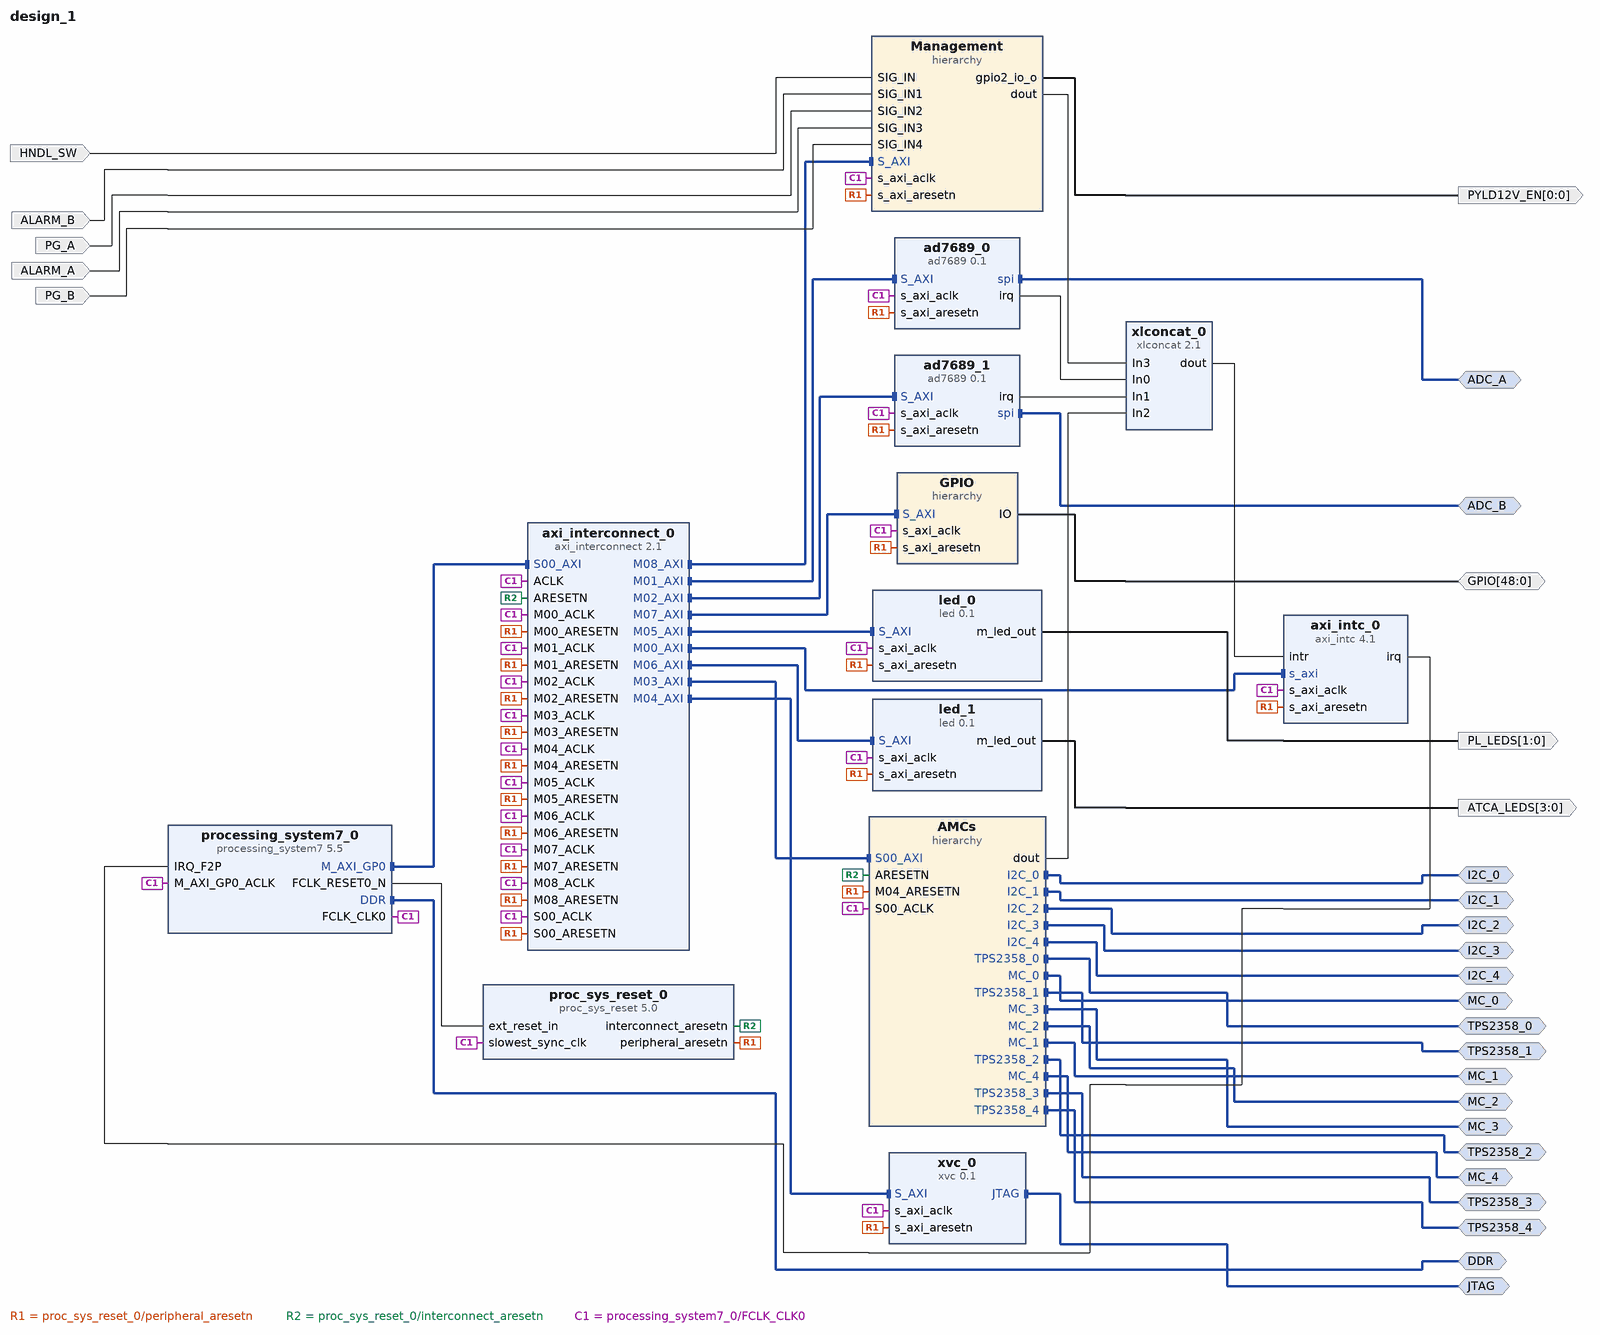
[diagram p0: block diagram of the top level]
# Vivado block design design_1, xc7z020clg400-1, Vivado 2017.2
create_bd_design design_1

create_bd_intf_port -mode Master -vlnv xilinx.com:interface:ddrx_rtl:1.0 DDR
create_bd_intf_port -mode Master -vlnv uw:uw:spi_rtl:1.0 ADC_A
create_bd_intf_port -mode Master -vlnv uw:uw:spi_rtl:1.0 ADC_B
create_bd_intf_port -mode Master -vlnv uw:uw:i2c_rtl:1.0 I2C_0
create_bd_intf_port -mode Master -vlnv uw:uw:tps2358_rtl:1.0 TPS2358_0
create_bd_intf_port -mode Master -vlnv uw:uw:i2c_rtl:1.0 I2C_1
create_bd_intf_port -mode Master -vlnv uw:uw:tps2358_rtl:1.0 TPS2358_1
create_bd_intf_port -mode Master -vlnv uw:uw:i2c_rtl:1.0 I2C_2
create_bd_intf_port -mode Master -vlnv uw:uw:tps2358_rtl:1.0 TPS2358_2
create_bd_intf_port -mode Master -vlnv uw:uw:i2c_rtl:1.0 I2C_3
create_bd_intf_port -mode Master -vlnv uw:uw:tps2358_rtl:1.0 TPS2358_3
create_bd_intf_port -mode Master -vlnv uw:uw:i2c_rtl:1.0 I2C_4
create_bd_intf_port -mode Master -vlnv uw:uw:tps2358_rtl:1.0 TPS2358_4
create_bd_intf_port -mode Master -vlnv uw:uw:mc_rtl:1.0 MC_0
create_bd_intf_port -mode Master -vlnv uw:uw:mc_rtl:1.0 MC_4
create_bd_intf_port -mode Master -vlnv uw:uw:mc_rtl:1.0 MC_3
create_bd_intf_port -mode Master -vlnv uw:uw:mc_rtl:1.0 MC_2
create_bd_intf_port -mode Master -vlnv uw:uw:mc_rtl:1.0 MC_1
create_bd_intf_port -mode Master -vlnv uw:uw:jtag_rtl:1.0 JTAG
create_bd_port -dir O -from 1 -to 0 PL_LEDS
create_bd_port -dir O -from 3 -to 0 ATCA_LEDS
create_bd_port -dir IO -from 48 -to 0 GPIO
create_bd_port -dir O -from 0 -to 0 PYLD12V_EN
create_bd_port -dir I HNDL_SW
create_bd_port -dir I ALARM_B
create_bd_port -dir I PG_A
create_bd_port -dir I ALARM_A
create_bd_port -dir I PG_B

create_bd_cell -type ip -vlnv user.org:user:ad7689:0.1 ad7689_0
create_bd_cell -type ip -vlnv user.org:user:ad7689:0.1 ad7689_1
create_bd_cell -type hier AMCs
create_bd_cell -type ip -vlnv uw:uw:led:0.1 led_0
set_property -dict {CONFIG.C_ACTIVE_HIGH false} [get_bd_cells led_0]
create_bd_cell -type ip -vlnv uw:uw:led:0.1 led_1
set_property -dict {CONFIG.C_LED_INTERFACES 4} [get_bd_cells led_1]
create_bd_cell -type hier GPIO
create_bd_cell -type hier Management
create_bd_cell -type ip -vlnv xilinx.com:ip:axi_intc:4.1 axi_intc_0
set_property -dict [list \
  CONFIG.C_NUM_SW_INTR 0 \
  CONFIG.Sense_of_IRQ_Level_Type Active_High \
  CONFIG.C_EN_CASCADE_MODE 0 \
  CONFIG.C_IRQ_CONNECTION 1 \
] [get_bd_cells axi_intc_0]
create_bd_cell -type ip -vlnv xilinx.com:ip:axi_interconnect:2.1 axi_interconnect_0
set_property -dict [list \
  CONFIG.NUM_SI 1 \
  CONFIG.NUM_MI 9 \
  CONFIG.STRATEGY 0 \
  CONFIG.S00_HAS_DATA_FIFO 2 \
  CONFIG.S01_HAS_DATA_FIFO 2 \
] [get_bd_cells axi_interconnect_0]
create_bd_cell -type ip -vlnv xilinx.com:ip:proc_sys_reset:5.0 proc_sys_reset_0
create_bd_cell -type ip -vlnv xilinx.com:ip:processing_system7:5.5 processing_system7_0
set_property -dict [list \
  CONFIG.PCW_FCLK_CLK1_BUF TRUE \
  CONFIG.PCW_I2C_PERIPHERAL_FREQMHZ 111.111115 \
  CONFIG.PCW_FPGA0_PERIPHERAL_FREQMHZ 50 \
  CONFIG.PCW_FPGA1_PERIPHERAL_FREQMHZ 100 \
  CONFIG.PCW_USE_FABRIC_INTERRUPT 1 \
  CONFIG.PCW_EN_CLK1_PORT 1 \
  CONFIG.PCW_IRQ_F2P_INTR 1 \
  CONFIG.PCW_GP0_EN_MODIFIABLE_TXN 0 \
  CONFIG.PCW_GP1_EN_MODIFIABLE_TXN 0 \
  CONFIG.PCW_PRESET_BANK1_VOLTAGE {LVCMOS 1.8V} \
  CONFIG.PCW_UIPARAM_DDR_BUS_WIDTH {16 Bit} \
  CONFIG.PCW_UIPARAM_DDR_PARTNO {MT41K128M16 JT-125} \
  CONFIG.PCW_QSPI_PERIPHERAL_ENABLE 1 \
  CONFIG.PCW_QSPI_QSPI_IO {MIO 1 .. 6} \
  CONFIG.PCW_QSPI_GRP_SINGLE_SS_ENABLE 1 \
  CONFIG.PCW_QSPI_GRP_SINGLE_SS_IO {MIO 1 .. 6} \
  CONFIG.PCW_QSPI_GRP_FBCLK_ENABLE 1 \
  CONFIG.PCW_QSPI_GRP_FBCLK_IO {MIO 8} \
  CONFIG.PCW_ENET0_PERIPHERAL_ENABLE 1 \
  CONFIG.PCW_ENET0_ENET0_IO {MIO 16 .. 27} \
  CONFIG.PCW_ENET0_GRP_MDIO_ENABLE 1 \
  CONFIG.PCW_ENET0_GRP_MDIO_IO {MIO 52 .. 53} \
  CONFIG.PCW_ENET0_RESET_ENABLE 1 \
  CONFIG.PCW_ENET0_RESET_IO {MIO 9} \
  CONFIG.PCW_UART0_PERIPHERAL_ENABLE 1 \
  CONFIG.PCW_UART0_UART0_IO {MIO 14 .. 15} \
  CONFIG.PCW_SPI0_PERIPHERAL_ENABLE 1 \
  CONFIG.PCW_SPI0_SPI0_IO {MIO 28 .. 33} \
  CONFIG.PCW_SPI0_GRP_SS1_ENABLE 1 \
  CONFIG.PCW_I2C0_PERIPHERAL_ENABLE 1 \
  CONFIG.PCW_I2C0_I2C0_IO {MIO 10 .. 11} \
  CONFIG.PCW_I2C1_PERIPHERAL_ENABLE 1 \
  CONFIG.PCW_I2C1_I2C1_IO {MIO 12 .. 13} \
  CONFIG.PCW_GPIO_MIO_GPIO_ENABLE 1 \
  CONFIG.PCW_FPGA_FCLK1_ENABLE 1 \
] [get_bd_cells processing_system7_0]
# 118 more settings of processing_system7_0 are not shown: defaults, MIO pin electricals, DDR timing, and values the tool derives
create_bd_cell -type ip -vlnv xilinx.com:ip:xlconcat:2.1 xlconcat_0
set_property -dict {CONFIG.NUM_PORTS 4 CONFIG.dout_width 27} [get_bd_cells xlconcat_0]
create_bd_cell -type ip -vlnv user.org:user:xvc:0.1 xvc_0

# ---- hierarchy /AMCs ----
current_bd_instance /AMCs
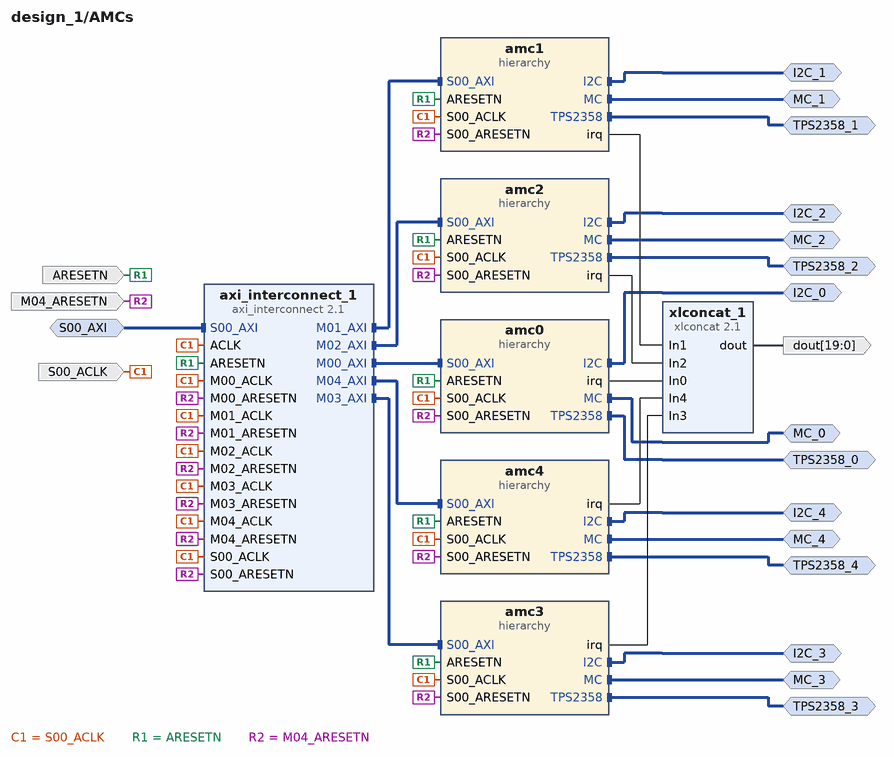
[diagram p1: block diagram inside /AMCs]
create_bd_intf_pin -mode Slave -vlnv xilinx.com:interface:aximm_rtl:1.0 S00_AXI
create_bd_intf_pin -mode Master -vlnv uw:uw:tps2358_rtl:1.0 TPS2358_1
create_bd_intf_pin -mode Master -vlnv uw:uw:i2c_rtl:1.0 I2C_1
create_bd_intf_pin -mode Master -vlnv uw:uw:mc_rtl:1.0 MC_1
create_bd_intf_pin -mode Master -vlnv uw:uw:i2c_rtl:1.0 I2C_2
create_bd_intf_pin -mode Master -vlnv uw:uw:tps2358_rtl:1.0 TPS2358_2
create_bd_intf_pin -mode Master -vlnv uw:uw:mc_rtl:1.0 MC_2
create_bd_intf_pin -mode Master -vlnv uw:uw:i2c_rtl:1.0 I2C_0
create_bd_intf_pin -mode Master -vlnv uw:uw:tps2358_rtl:1.0 TPS2358_0
create_bd_intf_pin -mode Master -vlnv uw:uw:mc_rtl:1.0 MC_0
create_bd_intf_pin -mode Master -vlnv uw:uw:tps2358_rtl:1.0 TPS2358_4
create_bd_intf_pin -mode Master -vlnv uw:uw:i2c_rtl:1.0 I2C_4
create_bd_intf_pin -mode Master -vlnv uw:uw:mc_rtl:1.0 MC_4
create_bd_intf_pin -mode Master -vlnv uw:uw:tps2358_rtl:1.0 TPS2358_3
create_bd_intf_pin -mode Master -vlnv uw:uw:i2c_rtl:1.0 I2C_3
create_bd_intf_pin -mode Master -vlnv uw:uw:mc_rtl:1.0 MC_3
create_bd_pin -dir I -type clk S00_ACLK
create_bd_pin -dir I -type rst ARESETN
create_bd_pin -dir I -type rst M04_ARESETN
create_bd_pin -dir O -from 19 -to 0 dout

create_bd_cell -type hier amc1
create_bd_cell -type hier amc2
create_bd_cell -type hier amc0
create_bd_cell -type hier amc4
create_bd_cell -type hier amc3
create_bd_cell -type ip -vlnv xilinx.com:ip:axi_interconnect:2.1 axi_interconnect_1
set_property -dict {CONFIG.NUM_MI 5} [get_bd_cells axi_interconnect_1]
create_bd_cell -type ip -vlnv xilinx.com:ip:xlconcat:2.1 xlconcat_1
set_property -dict {CONFIG.NUM_PORTS 5 CONFIG.dout_width 20} [get_bd_cells xlconcat_1]

# ---- hierarchy /AMCs/amc1 ----
current_bd_instance /AMCs/amc1
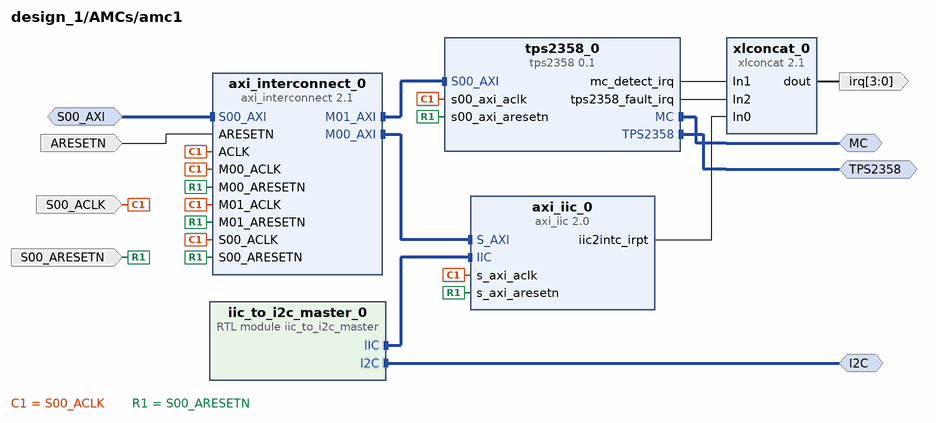
[diagram p2: block diagram inside /AMCs/amc1]
create_bd_intf_pin -mode Master -vlnv uw:uw:i2c_rtl:1.0 I2C
create_bd_intf_pin -mode Master -vlnv uw:uw:tps2358_rtl:1.0 TPS2358
create_bd_intf_pin -mode Slave -vlnv xilinx.com:interface:aximm_rtl:1.0 S00_AXI
create_bd_intf_pin -mode Master -vlnv uw:uw:mc_rtl:1.0 MC
create_bd_pin -dir I -type clk S00_ACLK
create_bd_pin -dir I -type rst S00_ARESETN
create_bd_pin -dir O -from 3 -to 0 irq
create_bd_pin -dir I -type rst ARESETN

create_bd_cell -type ip -vlnv user.org:user:tps2358:0.1 tps2358_0
create_bd_cell -type ip -vlnv xilinx.com:ip:axi_iic:2.0 axi_iic_0
create_bd_cell -type ip -vlnv xilinx.com:ip:axi_interconnect:2.1 axi_interconnect_0
create_bd_cell -type ip -vlnv xilinx.com:ip:xlconcat:2.1 xlconcat_0
set_property -dict {CONFIG.NUM_PORTS 3 CONFIG.IN2_WIDTH 2 CONFIG.dout_width 4} [get_bd_cells xlconcat_0]
create_bd_cell -type module -reference iic_to_i2c_master iic_to_i2c_master_0

# ---- hierarchy /AMCs/amc2 ----
current_bd_instance /AMCs/amc2
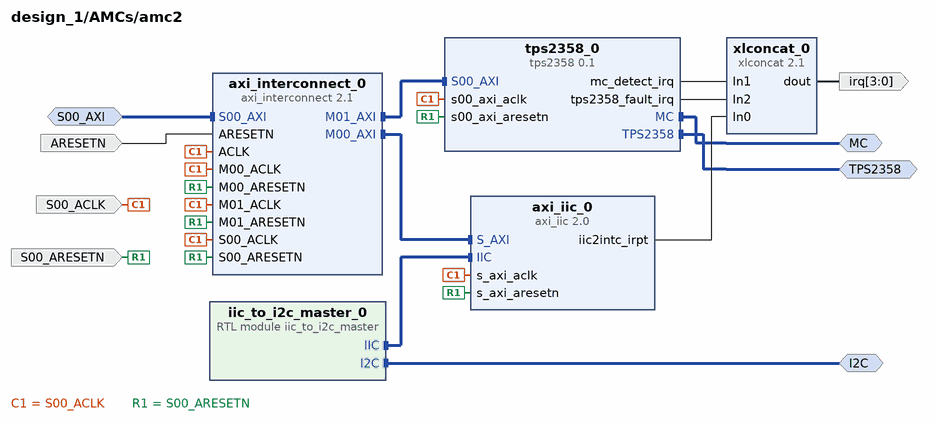
[diagram p3: block diagram inside /AMCs/amc2]
create_bd_intf_pin -mode Master -vlnv uw:uw:i2c_rtl:1.0 I2C
create_bd_intf_pin -mode Master -vlnv uw:uw:tps2358_rtl:1.0 TPS2358
create_bd_intf_pin -mode Slave -vlnv xilinx.com:interface:aximm_rtl:1.0 S00_AXI
create_bd_intf_pin -mode Master -vlnv uw:uw:mc_rtl:1.0 MC
create_bd_pin -dir I -type clk S00_ACLK
create_bd_pin -dir I -type rst S00_ARESETN
create_bd_pin -dir O -from 3 -to 0 irq
create_bd_pin -dir I -type rst ARESETN

create_bd_cell -type ip -vlnv user.org:user:tps2358:0.1 tps2358_0
create_bd_cell -type ip -vlnv xilinx.com:ip:axi_iic:2.0 axi_iic_0
create_bd_cell -type ip -vlnv xilinx.com:ip:axi_interconnect:2.1 axi_interconnect_0
create_bd_cell -type ip -vlnv xilinx.com:ip:xlconcat:2.1 xlconcat_0
set_property -dict {CONFIG.NUM_PORTS 3 CONFIG.IN2_WIDTH 2 CONFIG.dout_width 4} [get_bd_cells xlconcat_0]
create_bd_cell -type module -reference iic_to_i2c_master iic_to_i2c_master_0

# ---- hierarchy /AMCs/amc0 ----
current_bd_instance /AMCs/amc0
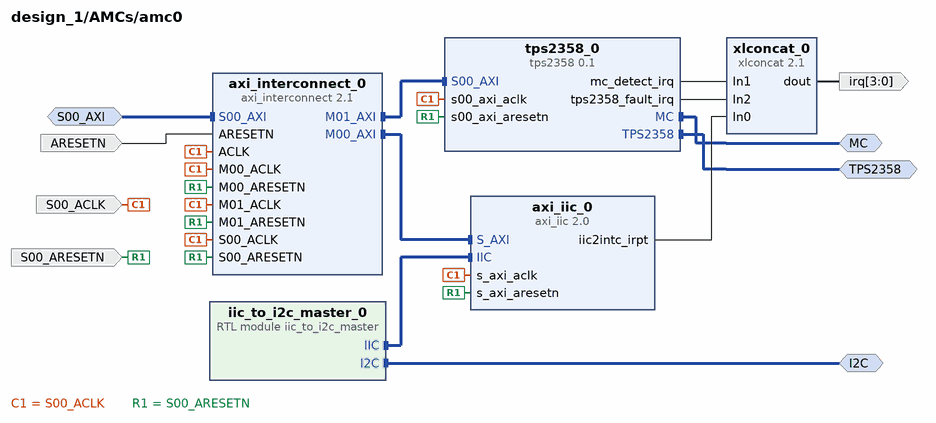
[diagram p4: block diagram inside /AMCs/amc0]
create_bd_intf_pin -mode Master -vlnv uw:uw:i2c_rtl:1.0 I2C
create_bd_intf_pin -mode Master -vlnv uw:uw:tps2358_rtl:1.0 TPS2358
create_bd_intf_pin -mode Slave -vlnv xilinx.com:interface:aximm_rtl:1.0 S00_AXI
create_bd_intf_pin -mode Master -vlnv uw:uw:mc_rtl:1.0 MC
create_bd_pin -dir I -type clk S00_ACLK
create_bd_pin -dir I -type rst S00_ARESETN
create_bd_pin -dir O -from 3 -to 0 irq
create_bd_pin -dir I -type rst ARESETN

create_bd_cell -type ip -vlnv user.org:user:tps2358:0.1 tps2358_0
create_bd_cell -type ip -vlnv xilinx.com:ip:axi_iic:2.0 axi_iic_0
create_bd_cell -type ip -vlnv xilinx.com:ip:axi_interconnect:2.1 axi_interconnect_0
create_bd_cell -type ip -vlnv xilinx.com:ip:xlconcat:2.1 xlconcat_0
set_property -dict {CONFIG.NUM_PORTS 3 CONFIG.IN2_WIDTH 2 CONFIG.dout_width 4} [get_bd_cells xlconcat_0]
create_bd_cell -type module -reference iic_to_i2c_master iic_to_i2c_master_0

# ---- hierarchy /AMCs/amc4 ----
current_bd_instance /AMCs/amc4
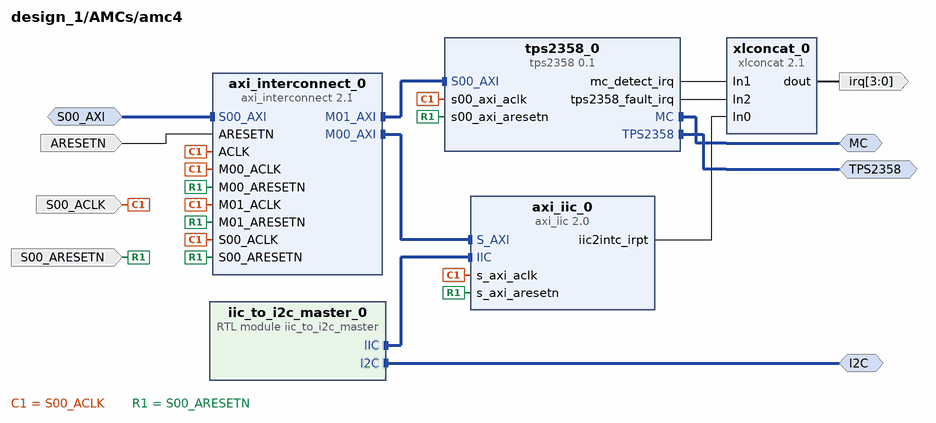
[diagram p5: block diagram inside /AMCs/amc4]
create_bd_intf_pin -mode Master -vlnv uw:uw:i2c_rtl:1.0 I2C
create_bd_intf_pin -mode Master -vlnv uw:uw:tps2358_rtl:1.0 TPS2358
create_bd_intf_pin -mode Slave -vlnv xilinx.com:interface:aximm_rtl:1.0 S00_AXI
create_bd_intf_pin -mode Master -vlnv uw:uw:mc_rtl:1.0 MC
create_bd_pin -dir I -type clk S00_ACLK
create_bd_pin -dir I -type rst S00_ARESETN
create_bd_pin -dir O -from 3 -to 0 irq
create_bd_pin -dir I -type rst ARESETN

create_bd_cell -type ip -vlnv user.org:user:tps2358:0.1 tps2358_0
create_bd_cell -type ip -vlnv xilinx.com:ip:axi_iic:2.0 axi_iic_0
create_bd_cell -type ip -vlnv xilinx.com:ip:axi_interconnect:2.1 axi_interconnect_0
create_bd_cell -type ip -vlnv xilinx.com:ip:xlconcat:2.1 xlconcat_0
set_property -dict {CONFIG.NUM_PORTS 3 CONFIG.IN2_WIDTH 2 CONFIG.dout_width 4} [get_bd_cells xlconcat_0]
create_bd_cell -type module -reference iic_to_i2c_master iic_to_i2c_master_0

# ---- hierarchy /AMCs/amc3 ----
current_bd_instance /AMCs/amc3
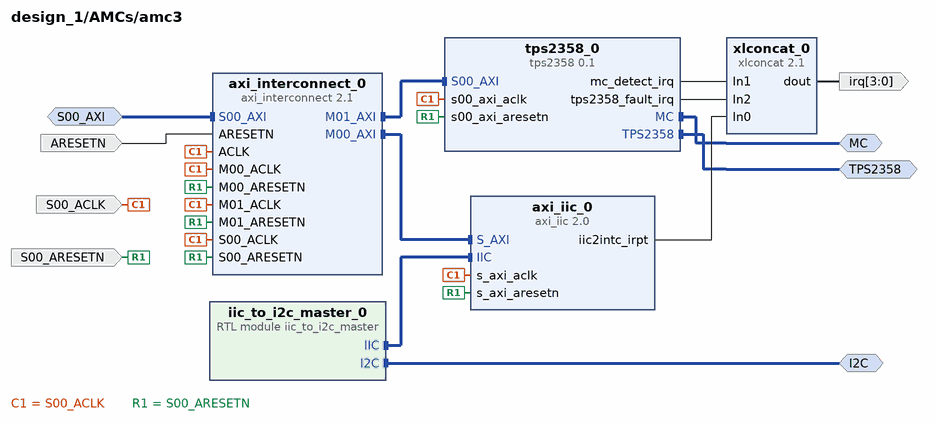
[diagram p6: block diagram inside /AMCs/amc3]
create_bd_intf_pin -mode Master -vlnv uw:uw:i2c_rtl:1.0 I2C
create_bd_intf_pin -mode Master -vlnv uw:uw:tps2358_rtl:1.0 TPS2358
create_bd_intf_pin -mode Slave -vlnv xilinx.com:interface:aximm_rtl:1.0 S00_AXI
create_bd_intf_pin -mode Master -vlnv uw:uw:mc_rtl:1.0 MC
create_bd_pin -dir I -type clk S00_ACLK
create_bd_pin -dir I -type rst S00_ARESETN
create_bd_pin -dir O -from 3 -to 0 irq
create_bd_pin -dir I -type rst ARESETN

create_bd_cell -type ip -vlnv user.org:user:tps2358:0.1 tps2358_0
create_bd_cell -type ip -vlnv xilinx.com:ip:axi_iic:2.0 axi_iic_0
create_bd_cell -type ip -vlnv xilinx.com:ip:axi_interconnect:2.1 axi_interconnect_0
create_bd_cell -type ip -vlnv xilinx.com:ip:xlconcat:2.1 xlconcat_0
set_property -dict {CONFIG.NUM_PORTS 3 CONFIG.IN2_WIDTH 2 CONFIG.dout_width 4} [get_bd_cells xlconcat_0]
create_bd_cell -type module -reference iic_to_i2c_master iic_to_i2c_master_0

# ---- hierarchy /GPIO ----
current_bd_instance /GPIO
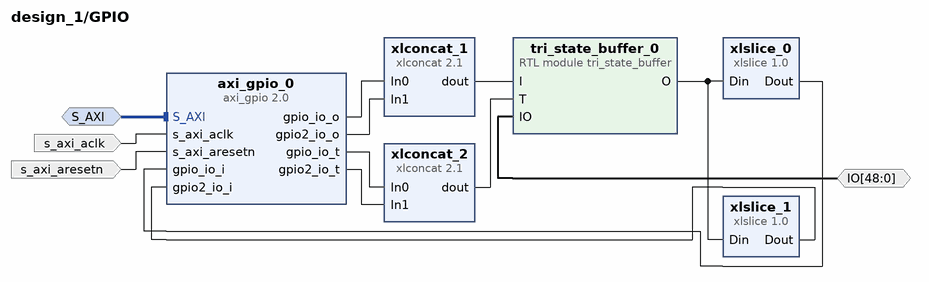
[diagram p7: block diagram inside /GPIO]
create_bd_intf_pin -mode Slave -vlnv xilinx.com:interface:aximm_rtl:1.0 S_AXI
create_bd_pin -dir IO -from 48 -to 0 IO
create_bd_pin -dir I -type clk s_axi_aclk
create_bd_pin -dir I -type rst s_axi_aresetn

create_bd_cell -type ip -vlnv xilinx.com:ip:axi_gpio:2.0 axi_gpio_0
set_property -dict {CONFIG.C_GPIO2_WIDTH 17 CONFIG.C_IS_DUAL 1} [get_bd_cells axi_gpio_0]
create_bd_cell -type ip -vlnv xilinx.com:ip:xlconcat:2.1 xlconcat_1
set_property -dict {CONFIG.dout_width 49} [get_bd_cells xlconcat_1]
create_bd_cell -type ip -vlnv xilinx.com:ip:xlconcat:2.1 xlconcat_2
set_property -dict {CONFIG.dout_width 49} [get_bd_cells xlconcat_2]
create_bd_cell -type ip -vlnv xilinx.com:ip:xlslice:1.0 xlslice_0
set_property -dict {CONFIG.DIN_TO 0 CONFIG.DIN_FROM 31 CONFIG.DIN_WIDTH 49 CONFIG.DOUT_WIDTH 32} [get_bd_cells xlslice_0]
create_bd_cell -type ip -vlnv xilinx.com:ip:xlslice:1.0 xlslice_1
set_property -dict {CONFIG.DIN_TO 32 CONFIG.DIN_FROM 48 CONFIG.DIN_WIDTH 49 CONFIG.DOUT_WIDTH 1} [get_bd_cells xlslice_1]
create_bd_cell -type module -reference tri_state_buffer tri_state_buffer_0

# ---- hierarchy /Management ----
current_bd_instance /Management
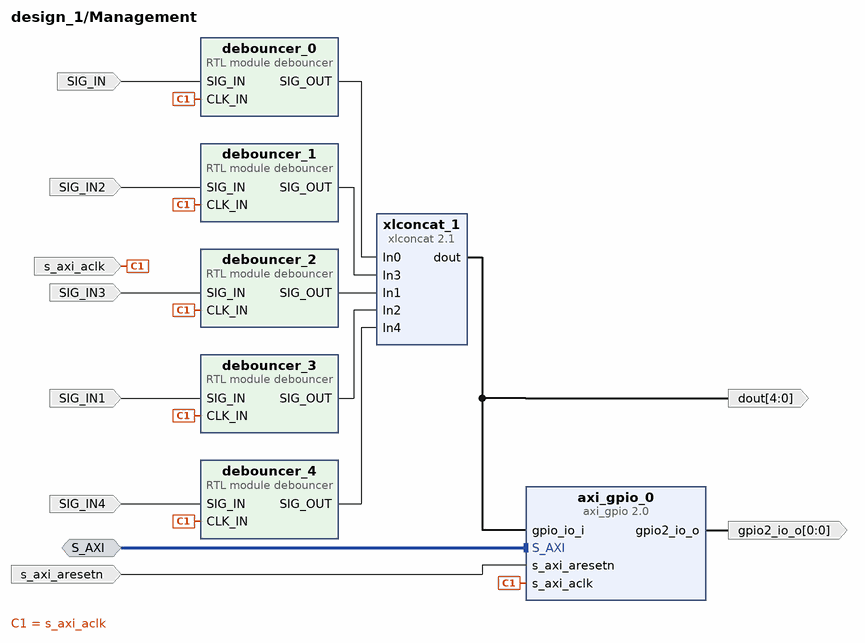
[diagram p8: block diagram inside /Management]
create_bd_intf_pin -mode Slave -vlnv xilinx.com:interface:aximm_rtl:1.0 S_AXI
create_bd_pin -dir O -from 4 -to 0 dout
create_bd_pin -dir I -type clk s_axi_aclk
create_bd_pin -dir I -type rst s_axi_aresetn
create_bd_pin -dir O -from 0 -to 0 gpio2_io_o
create_bd_pin -dir I SIG_IN
create_bd_pin -dir I SIG_IN1
create_bd_pin -dir I SIG_IN2
create_bd_pin -dir I SIG_IN3
create_bd_pin -dir I SIG_IN4

create_bd_cell -type ip -vlnv xilinx.com:ip:axi_gpio:2.0 axi_gpio_0
set_property -dict [list \
  CONFIG.C_GPIO_WIDTH 5 \
  CONFIG.C_GPIO2_WIDTH 1 \
  CONFIG.C_IS_DUAL 1 \
  CONFIG.C_ALL_INPUTS 1 \
  CONFIG.C_ALL_OUTPUTS_2 1 \
] [get_bd_cells axi_gpio_0]
create_bd_cell -type ip -vlnv xilinx.com:ip:xlconcat:2.1 xlconcat_1
set_property -dict [list \
  CONFIG.NUM_PORTS 5 \
  CONFIG.IN0_WIDTH 1 \
  CONFIG.IN1_WIDTH 1 \
  CONFIG.IN2_WIDTH 1 \
  CONFIG.IN3_WIDTH 1 \
  CONFIG.IN4_WIDTH 1 \
  CONFIG.dout_width 5 \
] [get_bd_cells xlconcat_1]
create_bd_cell -type module -reference debouncer debouncer_0
create_bd_cell -type module -reference debouncer debouncer_1
create_bd_cell -type module -reference debouncer debouncer_2
create_bd_cell -type module -reference debouncer debouncer_3
create_bd_cell -type module -reference debouncer debouncer_4

# ---- connections ----

current_bd_instance /AMCs
connect_bd_intf_net [get_bd_intf_pins axi_interconnect_1/M01_AXI] [get_bd_intf_pins amc1/S00_AXI]
connect_bd_intf_net [get_bd_intf_pins axi_interconnect_1/M02_AXI] [get_bd_intf_pins amc2/S00_AXI]
connect_bd_intf_net [get_bd_intf_pins axi_interconnect_1/M00_AXI] [get_bd_intf_pins amc0/S00_AXI]
connect_bd_intf_net [get_bd_intf_pins axi_interconnect_1/M04_AXI] [get_bd_intf_pins amc4/S00_AXI]
connect_bd_intf_net [get_bd_intf_pins axi_interconnect_1/M03_AXI] [get_bd_intf_pins amc3/S00_AXI]
connect_bd_intf_net [get_bd_intf_pins S00_AXI] [get_bd_intf_pins axi_interconnect_1/S00_AXI]
connect_bd_intf_net [get_bd_intf_pins TPS2358_1] [get_bd_intf_pins amc1/TPS2358]
connect_bd_intf_net [get_bd_intf_pins I2C_1] [get_bd_intf_pins amc1/I2C]
connect_bd_intf_net [get_bd_intf_pins MC_1] [get_bd_intf_pins amc1/MC]
connect_bd_intf_net [get_bd_intf_pins I2C_2] [get_bd_intf_pins amc2/I2C]
connect_bd_intf_net [get_bd_intf_pins TPS2358_2] [get_bd_intf_pins amc2/TPS2358]
connect_bd_intf_net [get_bd_intf_pins MC_2] [get_bd_intf_pins amc2/MC]
connect_bd_intf_net [get_bd_intf_pins I2C_0] [get_bd_intf_pins amc0/I2C]
connect_bd_intf_net [get_bd_intf_pins TPS2358_0] [get_bd_intf_pins amc0/TPS2358]
connect_bd_intf_net [get_bd_intf_pins MC_0] [get_bd_intf_pins amc0/MC]
connect_bd_intf_net [get_bd_intf_pins TPS2358_4] [get_bd_intf_pins amc4/TPS2358]
connect_bd_intf_net [get_bd_intf_pins I2C_4] [get_bd_intf_pins amc4/I2C]
connect_bd_intf_net [get_bd_intf_pins MC_4] [get_bd_intf_pins amc4/MC]
connect_bd_intf_net [get_bd_intf_pins TPS2358_3] [get_bd_intf_pins amc3/TPS2358]
connect_bd_intf_net [get_bd_intf_pins I2C_3] [get_bd_intf_pins amc3/I2C]
connect_bd_intf_net [get_bd_intf_pins MC_3] [get_bd_intf_pins amc3/MC]
connect_bd_net [get_bd_pins S00_ACLK] \
  [get_bd_pins amc1/S00_ACLK] [get_bd_pins amc2/S00_ACLK] [get_bd_pins amc0/S00_ACLK] [get_bd_pins amc4/S00_ACLK] \
  [get_bd_pins amc3/S00_ACLK] [get_bd_pins axi_interconnect_1/ACLK] [get_bd_pins axi_interconnect_1/S00_ACLK] \
  [get_bd_pins axi_interconnect_1/M00_ACLK] [get_bd_pins axi_interconnect_1/M01_ACLK] \
  [get_bd_pins axi_interconnect_1/M02_ACLK] [get_bd_pins axi_interconnect_1/M03_ACLK] \
  [get_bd_pins axi_interconnect_1/M04_ACLK]
connect_bd_net [get_bd_pins ARESETN] \
  [get_bd_pins amc1/ARESETN] [get_bd_pins amc2/ARESETN] [get_bd_pins amc0/ARESETN] [get_bd_pins amc4/ARESETN] \
  [get_bd_pins amc3/ARESETN] [get_bd_pins axi_interconnect_1/ARESETN]
connect_bd_net [get_bd_pins M04_ARESETN] \
  [get_bd_pins amc1/S00_ARESETN] [get_bd_pins amc2/S00_ARESETN] [get_bd_pins amc0/S00_ARESETN] [get_bd_pins amc4/S00_ARESETN] \
  [get_bd_pins amc3/S00_ARESETN] [get_bd_pins axi_interconnect_1/S00_ARESETN] [get_bd_pins axi_interconnect_1/M00_ARESETN] \
  [get_bd_pins axi_interconnect_1/M01_ARESETN] [get_bd_pins axi_interconnect_1/M02_ARESETN] \
  [get_bd_pins axi_interconnect_1/M03_ARESETN] [get_bd_pins axi_interconnect_1/M04_ARESETN]
connect_bd_net [get_bd_pins xlconcat_1/dout] [get_bd_pins dout]
connect_bd_net [get_bd_pins amc0/irq] [get_bd_pins xlconcat_1/In0]
connect_bd_net [get_bd_pins amc1/irq] [get_bd_pins xlconcat_1/In1]
connect_bd_net [get_bd_pins amc4/irq] [get_bd_pins xlconcat_1/In4]
connect_bd_net [get_bd_pins amc2/irq] [get_bd_pins xlconcat_1/In2]
connect_bd_net [get_bd_pins amc3/irq] [get_bd_pins xlconcat_1/In3]

current_bd_instance /AMCs/amc1
connect_bd_intf_net [get_bd_intf_pins iic_to_i2c_master_0/IIC] [get_bd_intf_pins axi_iic_0/IIC]
connect_bd_intf_net [get_bd_intf_pins axi_iic_0/S_AXI] [get_bd_intf_pins axi_interconnect_0/M00_AXI]
connect_bd_intf_net [get_bd_intf_pins tps2358_0/S00_AXI] [get_bd_intf_pins axi_interconnect_0/M01_AXI]
connect_bd_intf_net [get_bd_intf_pins I2C] [get_bd_intf_pins iic_to_i2c_master_0/I2C]
connect_bd_intf_net [get_bd_intf_pins TPS2358] [get_bd_intf_pins tps2358_0/TPS2358]
connect_bd_intf_net [get_bd_intf_pins S00_AXI] [get_bd_intf_pins axi_interconnect_0/S00_AXI]
connect_bd_intf_net [get_bd_intf_pins MC] [get_bd_intf_pins tps2358_0/MC]
connect_bd_net [get_bd_pins S00_ACLK] \
  [get_bd_pins tps2358_0/s00_axi_aclk] [get_bd_pins axi_iic_0/s_axi_aclk] [get_bd_pins axi_interconnect_0/ACLK] \
  [get_bd_pins axi_interconnect_0/S00_ACLK] [get_bd_pins axi_interconnect_0/M00_ACLK] \
  [get_bd_pins axi_interconnect_0/M01_ACLK]
connect_bd_net [get_bd_pins axi_iic_0/iic2intc_irpt] [get_bd_pins xlconcat_0/In0]
connect_bd_net [get_bd_pins xlconcat_0/dout] [get_bd_pins irq]
connect_bd_net [get_bd_pins ARESETN] [get_bd_pins axi_interconnect_0/ARESETN]
connect_bd_net [get_bd_pins S00_ARESETN] \
  [get_bd_pins tps2358_0/s00_axi_aresetn] [get_bd_pins axi_iic_0/s_axi_aresetn] [get_bd_pins axi_interconnect_0/S00_ARESETN] \
  [get_bd_pins axi_interconnect_0/M00_ARESETN] [get_bd_pins axi_interconnect_0/M01_ARESETN]
connect_bd_net [get_bd_pins tps2358_0/mc_detect_irq] [get_bd_pins xlconcat_0/In1]
connect_bd_net [get_bd_pins tps2358_0/tps2358_fault_irq] [get_bd_pins xlconcat_0/In2]

current_bd_instance /AMCs/amc2
connect_bd_intf_net [get_bd_intf_pins iic_to_i2c_master_0/IIC] [get_bd_intf_pins axi_iic_0/IIC]
connect_bd_intf_net [get_bd_intf_pins axi_iic_0/S_AXI] [get_bd_intf_pins axi_interconnect_0/M00_AXI]
connect_bd_intf_net [get_bd_intf_pins tps2358_0/S00_AXI] [get_bd_intf_pins axi_interconnect_0/M01_AXI]
connect_bd_intf_net [get_bd_intf_pins I2C] [get_bd_intf_pins iic_to_i2c_master_0/I2C]
connect_bd_intf_net [get_bd_intf_pins TPS2358] [get_bd_intf_pins tps2358_0/TPS2358]
connect_bd_intf_net [get_bd_intf_pins S00_AXI] [get_bd_intf_pins axi_interconnect_0/S00_AXI]
connect_bd_intf_net [get_bd_intf_pins MC] [get_bd_intf_pins tps2358_0/MC]
connect_bd_net [get_bd_pins S00_ACLK] \
  [get_bd_pins tps2358_0/s00_axi_aclk] [get_bd_pins axi_iic_0/s_axi_aclk] [get_bd_pins axi_interconnect_0/ACLK] \
  [get_bd_pins axi_interconnect_0/S00_ACLK] [get_bd_pins axi_interconnect_0/M00_ACLK] \
  [get_bd_pins axi_interconnect_0/M01_ACLK]
connect_bd_net [get_bd_pins axi_iic_0/iic2intc_irpt] [get_bd_pins xlconcat_0/In0]
connect_bd_net [get_bd_pins xlconcat_0/dout] [get_bd_pins irq]
connect_bd_net [get_bd_pins ARESETN] [get_bd_pins axi_interconnect_0/ARESETN]
connect_bd_net [get_bd_pins S00_ARESETN] \
  [get_bd_pins tps2358_0/s00_axi_aresetn] [get_bd_pins axi_iic_0/s_axi_aresetn] [get_bd_pins axi_interconnect_0/S00_ARESETN] \
  [get_bd_pins axi_interconnect_0/M00_ARESETN] [get_bd_pins axi_interconnect_0/M01_ARESETN]
connect_bd_net [get_bd_pins tps2358_0/mc_detect_irq] [get_bd_pins xlconcat_0/In1]
connect_bd_net [get_bd_pins tps2358_0/tps2358_fault_irq] [get_bd_pins xlconcat_0/In2]

current_bd_instance /AMCs/amc0
connect_bd_intf_net [get_bd_intf_pins iic_to_i2c_master_0/IIC] [get_bd_intf_pins axi_iic_0/IIC]
connect_bd_intf_net [get_bd_intf_pins axi_iic_0/S_AXI] [get_bd_intf_pins axi_interconnect_0/M00_AXI]
connect_bd_intf_net [get_bd_intf_pins tps2358_0/S00_AXI] [get_bd_intf_pins axi_interconnect_0/M01_AXI]
connect_bd_intf_net [get_bd_intf_pins I2C] [get_bd_intf_pins iic_to_i2c_master_0/I2C]
connect_bd_intf_net [get_bd_intf_pins TPS2358] [get_bd_intf_pins tps2358_0/TPS2358]
connect_bd_intf_net [get_bd_intf_pins S00_AXI] [get_bd_intf_pins axi_interconnect_0/S00_AXI]
connect_bd_intf_net [get_bd_intf_pins MC] [get_bd_intf_pins tps2358_0/MC]
connect_bd_net [get_bd_pins S00_ACLK] \
  [get_bd_pins tps2358_0/s00_axi_aclk] [get_bd_pins axi_iic_0/s_axi_aclk] [get_bd_pins axi_interconnect_0/ACLK] \
  [get_bd_pins axi_interconnect_0/S00_ACLK] [get_bd_pins axi_interconnect_0/M00_ACLK] \
  [get_bd_pins axi_interconnect_0/M01_ACLK]
connect_bd_net [get_bd_pins axi_iic_0/iic2intc_irpt] [get_bd_pins xlconcat_0/In0]
connect_bd_net [get_bd_pins xlconcat_0/dout] [get_bd_pins irq]
connect_bd_net [get_bd_pins ARESETN] [get_bd_pins axi_interconnect_0/ARESETN]
connect_bd_net [get_bd_pins S00_ARESETN] \
  [get_bd_pins tps2358_0/s00_axi_aresetn] [get_bd_pins axi_iic_0/s_axi_aresetn] [get_bd_pins axi_interconnect_0/S00_ARESETN] \
  [get_bd_pins axi_interconnect_0/M00_ARESETN] [get_bd_pins axi_interconnect_0/M01_ARESETN]
connect_bd_net [get_bd_pins tps2358_0/mc_detect_irq] [get_bd_pins xlconcat_0/In1]
connect_bd_net [get_bd_pins tps2358_0/tps2358_fault_irq] [get_bd_pins xlconcat_0/In2]

current_bd_instance /AMCs/amc4
connect_bd_intf_net [get_bd_intf_pins iic_to_i2c_master_0/IIC] [get_bd_intf_pins axi_iic_0/IIC]
connect_bd_intf_net [get_bd_intf_pins axi_iic_0/S_AXI] [get_bd_intf_pins axi_interconnect_0/M00_AXI]
connect_bd_intf_net [get_bd_intf_pins tps2358_0/S00_AXI] [get_bd_intf_pins axi_interconnect_0/M01_AXI]
connect_bd_intf_net [get_bd_intf_pins I2C] [get_bd_intf_pins iic_to_i2c_master_0/I2C]
connect_bd_intf_net [get_bd_intf_pins TPS2358] [get_bd_intf_pins tps2358_0/TPS2358]
connect_bd_intf_net [get_bd_intf_pins S00_AXI] [get_bd_intf_pins axi_interconnect_0/S00_AXI]
connect_bd_intf_net [get_bd_intf_pins MC] [get_bd_intf_pins tps2358_0/MC]
connect_bd_net [get_bd_pins S00_ACLK] \
  [get_bd_pins tps2358_0/s00_axi_aclk] [get_bd_pins axi_iic_0/s_axi_aclk] [get_bd_pins axi_interconnect_0/ACLK] \
  [get_bd_pins axi_interconnect_0/S00_ACLK] [get_bd_pins axi_interconnect_0/M00_ACLK] \
  [get_bd_pins axi_interconnect_0/M01_ACLK]
connect_bd_net [get_bd_pins axi_iic_0/iic2intc_irpt] [get_bd_pins xlconcat_0/In0]
connect_bd_net [get_bd_pins xlconcat_0/dout] [get_bd_pins irq]
connect_bd_net [get_bd_pins ARESETN] [get_bd_pins axi_interconnect_0/ARESETN]
connect_bd_net [get_bd_pins S00_ARESETN] \
  [get_bd_pins tps2358_0/s00_axi_aresetn] [get_bd_pins axi_iic_0/s_axi_aresetn] [get_bd_pins axi_interconnect_0/S00_ARESETN] \
  [get_bd_pins axi_interconnect_0/M00_ARESETN] [get_bd_pins axi_interconnect_0/M01_ARESETN]
connect_bd_net [get_bd_pins tps2358_0/mc_detect_irq] [get_bd_pins xlconcat_0/In1]
connect_bd_net [get_bd_pins tps2358_0/tps2358_fault_irq] [get_bd_pins xlconcat_0/In2]

current_bd_instance /AMCs/amc3
connect_bd_intf_net [get_bd_intf_pins iic_to_i2c_master_0/IIC] [get_bd_intf_pins axi_iic_0/IIC]
connect_bd_intf_net [get_bd_intf_pins axi_iic_0/S_AXI] [get_bd_intf_pins axi_interconnect_0/M00_AXI]
connect_bd_intf_net [get_bd_intf_pins tps2358_0/S00_AXI] [get_bd_intf_pins axi_interconnect_0/M01_AXI]
connect_bd_intf_net [get_bd_intf_pins I2C] [get_bd_intf_pins iic_to_i2c_master_0/I2C]
connect_bd_intf_net [get_bd_intf_pins TPS2358] [get_bd_intf_pins tps2358_0/TPS2358]
connect_bd_intf_net [get_bd_intf_pins S00_AXI] [get_bd_intf_pins axi_interconnect_0/S00_AXI]
connect_bd_intf_net [get_bd_intf_pins MC] [get_bd_intf_pins tps2358_0/MC]
connect_bd_net [get_bd_pins S00_ACLK] \
  [get_bd_pins tps2358_0/s00_axi_aclk] [get_bd_pins axi_iic_0/s_axi_aclk] [get_bd_pins axi_interconnect_0/ACLK] \
  [get_bd_pins axi_interconnect_0/S00_ACLK] [get_bd_pins axi_interconnect_0/M00_ACLK] \
  [get_bd_pins axi_interconnect_0/M01_ACLK]
connect_bd_net [get_bd_pins axi_iic_0/iic2intc_irpt] [get_bd_pins xlconcat_0/In0]
connect_bd_net [get_bd_pins xlconcat_0/dout] [get_bd_pins irq]
connect_bd_net [get_bd_pins ARESETN] [get_bd_pins axi_interconnect_0/ARESETN]
connect_bd_net [get_bd_pins S00_ARESETN] \
  [get_bd_pins tps2358_0/s00_axi_aresetn] [get_bd_pins axi_iic_0/s_axi_aresetn] [get_bd_pins axi_interconnect_0/S00_ARESETN] \
  [get_bd_pins axi_interconnect_0/M00_ARESETN] [get_bd_pins axi_interconnect_0/M01_ARESETN]
connect_bd_net [get_bd_pins tps2358_0/mc_detect_irq] [get_bd_pins xlconcat_0/In1]
connect_bd_net [get_bd_pins tps2358_0/tps2358_fault_irq] [get_bd_pins xlconcat_0/In2]

current_bd_instance /GPIO
connect_bd_intf_net [get_bd_intf_pins S_AXI] [get_bd_intf_pins axi_gpio_0/S_AXI]
connect_bd_net [get_bd_pins IO] [get_bd_pins tri_state_buffer_0/IO]
connect_bd_net [get_bd_pins tri_state_buffer_0/O] [get_bd_pins xlslice_0/Din] [get_bd_pins xlslice_1/Din]
connect_bd_net [get_bd_pins xlslice_0/Dout] [get_bd_pins axi_gpio_0/gpio_io_i]
connect_bd_net [get_bd_pins xlslice_1/Dout] [get_bd_pins axi_gpio_0/gpio2_io_i]
connect_bd_net [get_bd_pins axi_gpio_0/gpio_io_o] [get_bd_pins xlconcat_1/In0]
connect_bd_net [get_bd_pins axi_gpio_0/gpio2_io_o] [get_bd_pins xlconcat_1/In1]
connect_bd_net [get_bd_pins xlconcat_1/dout] [get_bd_pins tri_state_buffer_0/I]
connect_bd_net [get_bd_pins axi_gpio_0/gpio_io_t] [get_bd_pins xlconcat_2/In0]
connect_bd_net [get_bd_pins axi_gpio_0/gpio2_io_t] [get_bd_pins xlconcat_2/In1]
connect_bd_net [get_bd_pins xlconcat_2/dout] [get_bd_pins tri_state_buffer_0/T]
connect_bd_net [get_bd_pins s_axi_aclk] [get_bd_pins axi_gpio_0/s_axi_aclk]
connect_bd_net [get_bd_pins s_axi_aresetn] [get_bd_pins axi_gpio_0/s_axi_aresetn]

current_bd_instance /Management
connect_bd_intf_net [get_bd_intf_pins S_AXI] [get_bd_intf_pins axi_gpio_0/S_AXI]
connect_bd_net [get_bd_pins xlconcat_1/dout] [get_bd_pins dout] [get_bd_pins axi_gpio_0/gpio_io_i]
connect_bd_net [get_bd_pins s_axi_aclk] \
  [get_bd_pins axi_gpio_0/s_axi_aclk] [get_bd_pins debouncer_0/CLK_IN] [get_bd_pins debouncer_1/CLK_IN] \
  [get_bd_pins debouncer_2/CLK_IN] [get_bd_pins debouncer_3/CLK_IN] [get_bd_pins debouncer_4/CLK_IN]
connect_bd_net [get_bd_pins s_axi_aresetn] [get_bd_pins axi_gpio_0/s_axi_aresetn]
connect_bd_net [get_bd_pins axi_gpio_0/gpio2_io_o] [get_bd_pins gpio2_io_o]
connect_bd_net [get_bd_pins SIG_IN] [get_bd_pins debouncer_0/SIG_IN]
connect_bd_net [get_bd_pins debouncer_0/SIG_OUT] [get_bd_pins xlconcat_1/In0]
connect_bd_net -net SIG_IN1_1 [get_bd_pins SIG_IN1] [get_bd_pins debouncer_3/SIG_IN]
connect_bd_net [get_bd_pins debouncer_3/SIG_OUT] [get_bd_pins xlconcat_1/In2]
connect_bd_net -net SIG_IN2_1 [get_bd_pins SIG_IN2] [get_bd_pins debouncer_1/SIG_IN]
connect_bd_net [get_bd_pins debouncer_1/SIG_OUT] [get_bd_pins xlconcat_1/In3]
connect_bd_net -net SIG_IN3_1 [get_bd_pins SIG_IN3] [get_bd_pins debouncer_2/SIG_IN]
connect_bd_net [get_bd_pins debouncer_2/SIG_OUT] [get_bd_pins xlconcat_1/In1]
connect_bd_net -net SIG_IN4_1 [get_bd_pins SIG_IN4] [get_bd_pins debouncer_4/SIG_IN]
connect_bd_net [get_bd_pins debouncer_4/SIG_OUT] [get_bd_pins xlconcat_1/In4]

current_bd_instance /
connect_bd_intf_net [get_bd_intf_pins axi_interconnect_0/M00_AXI] [get_bd_intf_pins axi_intc_0/s_axi]
connect_bd_intf_net [get_bd_intf_pins axi_interconnect_0/S00_AXI] [get_bd_intf_pins processing_system7_0/M_AXI_GP0]
connect_bd_intf_net [get_bd_intf_pins ad7689_0/S_AXI] [get_bd_intf_pins axi_interconnect_0/M01_AXI]
connect_bd_intf_net [get_bd_intf_pins ad7689_1/S_AXI] [get_bd_intf_pins axi_interconnect_0/M02_AXI]
connect_bd_intf_net [get_bd_intf_pins axi_interconnect_0/M03_AXI] [get_bd_intf_pins AMCs/S00_AXI]
connect_bd_intf_net [get_bd_intf_pins xvc_0/S_AXI] [get_bd_intf_pins axi_interconnect_0/M04_AXI]
connect_bd_intf_net [get_bd_intf_pins led_0/S_AXI] [get_bd_intf_pins axi_interconnect_0/M05_AXI]
connect_bd_intf_net [get_bd_intf_pins led_1/S_AXI] [get_bd_intf_pins axi_interconnect_0/M06_AXI]
connect_bd_intf_net [get_bd_intf_pins axi_interconnect_0/M07_AXI] [get_bd_intf_pins GPIO/S_AXI]
connect_bd_intf_net [get_bd_intf_pins axi_interconnect_0/M08_AXI] [get_bd_intf_pins Management/S_AXI]
connect_bd_intf_net [get_bd_intf_ports DDR] [get_bd_intf_pins processing_system7_0/DDR]
connect_bd_intf_net [get_bd_intf_ports ADC_A] [get_bd_intf_pins ad7689_0/spi]
connect_bd_intf_net [get_bd_intf_ports ADC_B] [get_bd_intf_pins ad7689_1/spi]
connect_bd_intf_net [get_bd_intf_ports I2C_0] [get_bd_intf_pins AMCs/I2C_0]
connect_bd_intf_net -intf_net AMCs_TPS2360 [get_bd_intf_ports TPS2358_0] [get_bd_intf_pins AMCs/TPS2358_0]
connect_bd_intf_net [get_bd_intf_ports I2C_1] [get_bd_intf_pins AMCs/I2C_1]
connect_bd_intf_net -intf_net AMCs_TPS2358 [get_bd_intf_ports TPS2358_1] [get_bd_intf_pins AMCs/TPS2358_1]
connect_bd_intf_net [get_bd_intf_ports I2C_2] [get_bd_intf_pins AMCs/I2C_2]
connect_bd_intf_net -intf_net AMCs_TPS2359 [get_bd_intf_ports TPS2358_2] [get_bd_intf_pins AMCs/TPS2358_2]
connect_bd_intf_net [get_bd_intf_ports I2C_3] [get_bd_intf_pins AMCs/I2C_3]
connect_bd_intf_net -intf_net AMCs_TPS2362 [get_bd_intf_ports TPS2358_3] [get_bd_intf_pins AMCs/TPS2358_3]
connect_bd_intf_net [get_bd_intf_ports I2C_4] [get_bd_intf_pins AMCs/I2C_4]
connect_bd_intf_net -intf_net AMCs_TPS2361 [get_bd_intf_ports TPS2358_4] [get_bd_intf_pins AMCs/TPS2358_4]
connect_bd_intf_net [get_bd_intf_ports MC_0] [get_bd_intf_pins AMCs/MC_0]
connect_bd_intf_net [get_bd_intf_ports MC_4] [get_bd_intf_pins AMCs/MC_4]
connect_bd_intf_net [get_bd_intf_ports MC_3] [get_bd_intf_pins AMCs/MC_3]
connect_bd_intf_net [get_bd_intf_ports MC_2] [get_bd_intf_pins AMCs/MC_2]
connect_bd_intf_net [get_bd_intf_ports MC_1] [get_bd_intf_pins AMCs/MC_1]
connect_bd_intf_net [get_bd_intf_ports JTAG] [get_bd_intf_pins xvc_0/JTAG]
connect_bd_net [get_bd_pins processing_system7_0/FCLK_RESET0_N] [get_bd_pins proc_sys_reset_0/ext_reset_in]
connect_bd_net [get_bd_pins ad7689_0/irq] [get_bd_pins xlconcat_0/In0]
connect_bd_net [get_bd_pins ad7689_1/irq] [get_bd_pins xlconcat_0/In1]
connect_bd_net [get_bd_pins xlconcat_0/dout] [get_bd_pins axi_intc_0/intr]
connect_bd_net [get_bd_pins proc_sys_reset_0/peripheral_aresetn] \
  [get_bd_pins ad7689_0/s_axi_aresetn] [get_bd_pins ad7689_1/s_axi_aresetn] [get_bd_pins led_0/s_axi_aresetn] \
  [get_bd_pins led_1/s_axi_aresetn] [get_bd_pins axi_intc_0/s_axi_aresetn] [get_bd_pins xvc_0/s_axi_aresetn] \
  [get_bd_pins AMCs/M04_ARESETN] [get_bd_pins GPIO/s_axi_aresetn] [get_bd_pins Management/s_axi_aresetn] \
  [get_bd_pins axi_interconnect_0/S00_ARESETN] [get_bd_pins axi_interconnect_0/M00_ARESETN] \
  [get_bd_pins axi_interconnect_0/M01_ARESETN] [get_bd_pins axi_interconnect_0/M02_ARESETN] \
  [get_bd_pins axi_interconnect_0/M03_ARESETN] [get_bd_pins axi_interconnect_0/M04_ARESETN] \
  [get_bd_pins axi_interconnect_0/M05_ARESETN] [get_bd_pins axi_interconnect_0/M06_ARESETN] \
  [get_bd_pins axi_interconnect_0/M07_ARESETN] [get_bd_pins axi_interconnect_0/M08_ARESETN]
connect_bd_net -net ARESETN_1 [get_bd_pins proc_sys_reset_0/interconnect_aresetn] [get_bd_pins AMCs/ARESETN] [get_bd_pins axi_interconnect_0/ARESETN]
connect_bd_net -net ACLK_1 [get_bd_pins processing_system7_0/FCLK_CLK0] \
  [get_bd_pins ad7689_0/s_axi_aclk] [get_bd_pins ad7689_1/s_axi_aclk] [get_bd_pins led_0/s_axi_aclk] \
  [get_bd_pins led_1/s_axi_aclk] [get_bd_pins axi_intc_0/s_axi_aclk] [get_bd_pins proc_sys_reset_0/slowest_sync_clk] \
  [get_bd_pins processing_system7_0/M_AXI_GP0_ACLK] [get_bd_pins xvc_0/s_axi_aclk] [get_bd_pins AMCs/S00_ACLK] \
  [get_bd_pins GPIO/s_axi_aclk] [get_bd_pins Management/s_axi_aclk] [get_bd_pins axi_interconnect_0/ACLK] \
  [get_bd_pins axi_interconnect_0/S00_ACLK] [get_bd_pins axi_interconnect_0/M00_ACLK] \
  [get_bd_pins axi_interconnect_0/M01_ACLK] [get_bd_pins axi_interconnect_0/M02_ACLK] \
  [get_bd_pins axi_interconnect_0/M03_ACLK] [get_bd_pins axi_interconnect_0/M04_ACLK] \
  [get_bd_pins axi_interconnect_0/M05_ACLK] [get_bd_pins axi_interconnect_0/M06_ACLK] \
  [get_bd_pins axi_interconnect_0/M07_ACLK] [get_bd_pins axi_interconnect_0/M08_ACLK]
connect_bd_net [get_bd_pins AMCs/dout] [get_bd_pins xlconcat_0/In2]
connect_bd_net [get_bd_pins axi_intc_0/irq] [get_bd_pins processing_system7_0/IRQ_F2P]
connect_bd_net [get_bd_pins led_0/m_led_out] [get_bd_ports PL_LEDS]
connect_bd_net [get_bd_pins led_1/m_led_out] [get_bd_ports ATCA_LEDS]
connect_bd_net [get_bd_ports GPIO] [get_bd_pins GPIO/IO]
connect_bd_net -net xlconcat_1_dout [get_bd_pins Management/dout] [get_bd_pins xlconcat_0/In3]
connect_bd_net [get_bd_pins Management/gpio2_io_o] [get_bd_ports PYLD12V_EN]
connect_bd_net [get_bd_ports HNDL_SW] [get_bd_pins Management/SIG_IN]
connect_bd_net [get_bd_ports ALARM_B] [get_bd_pins Management/SIG_IN1]
connect_bd_net [get_bd_ports PG_A] [get_bd_pins Management/SIG_IN2]
connect_bd_net [get_bd_ports ALARM_A] [get_bd_pins Management/SIG_IN3]
connect_bd_net [get_bd_ports PG_B] [get_bd_pins Management/SIG_IN4]

# ---- address map ----
assign_bd_address -offset 0x41200000 -range 64K -target_address_space [get_bd_addr_spaces processing_system7_0/Data] [get_bd_addr_segs GPIO/axi_gpio_0/S_AXI/Reg]
assign_bd_address -offset 0x41210000 -range 64K -target_address_space [get_bd_addr_spaces processing_system7_0/Data] [get_bd_addr_segs Management/axi_gpio_0/S_AXI/Reg]
assign_bd_address -offset 0x41600000 -range 64K -target_address_space [get_bd_addr_spaces processing_system7_0/Data] [get_bd_addr_segs AMCs/amc0/axi_iic_0/S_AXI/Reg]
assign_bd_address -offset 0x41610000 -range 64K -target_address_space [get_bd_addr_spaces processing_system7_0/Data] [get_bd_addr_segs AMCs/amc1/axi_iic_0/S_AXI/Reg]
assign_bd_address -offset 0x41620000 -range 64K -target_address_space [get_bd_addr_spaces processing_system7_0/Data] [get_bd_addr_segs AMCs/amc2/axi_iic_0/S_AXI/Reg]
assign_bd_address -offset 0x41630000 -range 64K -target_address_space [get_bd_addr_spaces processing_system7_0/Data] [get_bd_addr_segs AMCs/amc3/axi_iic_0/S_AXI/Reg]
assign_bd_address -offset 0x41640000 -range 64K -target_address_space [get_bd_addr_spaces processing_system7_0/Data] [get_bd_addr_segs AMCs/amc4/axi_iic_0/S_AXI/Reg]
assign_bd_address -offset 0x41800000 -range 64K -target_address_space [get_bd_addr_spaces processing_system7_0/Data] [get_bd_addr_segs axi_intc_0/S_AXI/Reg]
assign_bd_address -offset 0x43C00000 -range 64K -target_address_space [get_bd_addr_spaces processing_system7_0/Data] [get_bd_addr_segs ad7689_0/S_AXI/S_AXI_reg]
assign_bd_address -offset 0x43C10000 -range 64K -target_address_space [get_bd_addr_spaces processing_system7_0/Data] [get_bd_addr_segs ad7689_1/S_AXI/S_AXI_reg]
assign_bd_address -offset 0x43C20000 -range 64K -target_address_space [get_bd_addr_spaces processing_system7_0/Data] [get_bd_addr_segs AMCs/amc0/tps2358_0/S00_AXI/S00_AXI_reg]
assign_bd_address -offset 0x43C30000 -range 64K -target_address_space [get_bd_addr_spaces processing_system7_0/Data] [get_bd_addr_segs AMCs/amc1/tps2358_0/S00_AXI/S00_AXI_reg]
assign_bd_address -offset 0x43C40000 -range 64K -target_address_space [get_bd_addr_spaces processing_system7_0/Data] [get_bd_addr_segs AMCs/amc2/tps2358_0/S00_AXI/S00_AXI_reg]
assign_bd_address -offset 0x43C50000 -range 64K -target_address_space [get_bd_addr_spaces processing_system7_0/Data] [get_bd_addr_segs AMCs/amc3/tps2358_0/S00_AXI/S00_AXI_reg]
assign_bd_address -offset 0x43C60000 -range 64K -target_address_space [get_bd_addr_spaces processing_system7_0/Data] [get_bd_addr_segs AMCs/amc4/tps2358_0/S00_AXI/S00_AXI_reg]
assign_bd_address -offset 0x43C70000 -range 64K -target_address_space [get_bd_addr_spaces processing_system7_0/Data] [get_bd_addr_segs xvc_0/S_AXI/S_AXI_reg]
assign_bd_address -offset 0x43C80000 -range 64K -target_address_space [get_bd_addr_spaces processing_system7_0/Data] [get_bd_addr_segs led_0/S_AXI/S_AXI_reg]
assign_bd_address -offset 0x43C90000 -range 64K -target_address_space [get_bd_addr_spaces processing_system7_0/Data] [get_bd_addr_segs led_1/S_AXI/S_AXI_reg]

validate_bd_design
save_bd_design
